# EAGLE design Hardware_Comp_V1.4 (EAGLE 9.5.2)
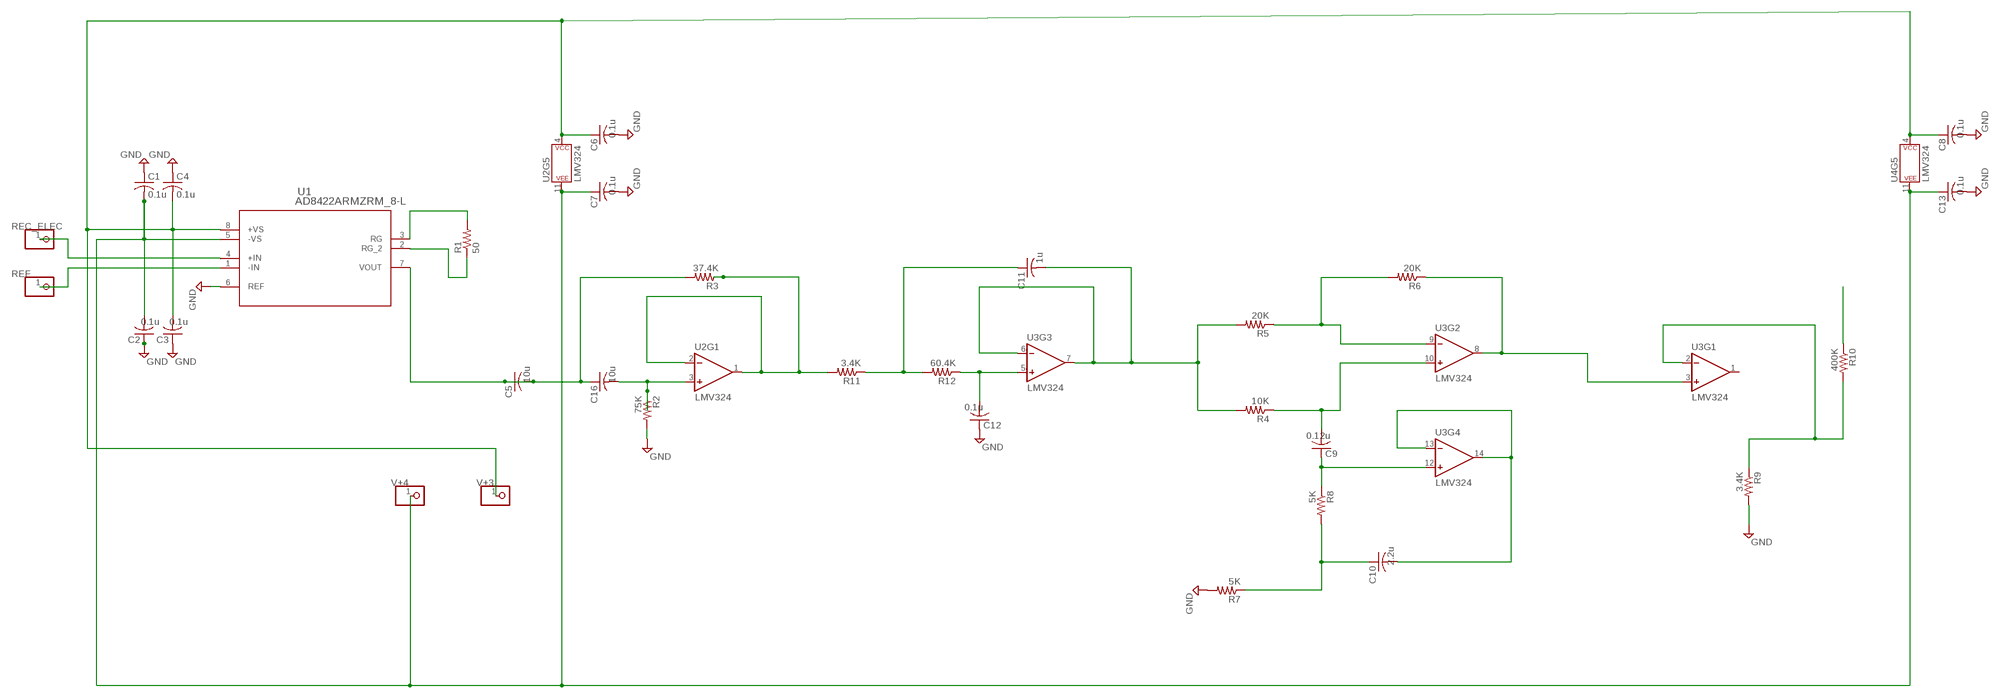
[diagram p0: schematic, sheet 1]

## Parts
9V-  PINHD-1X1  [1X01]
C1  0.1u  C-USC0603  [C0603]
C2  0.1u  C-USC0603  [C0603]
C3  0.1u  C-USC0603  [C0603]
C4  0.1u  C-USC0603  [C0603]
C5  10u  C-USC0603  [C0603]
C6  0.1u  C-USC0603  [C0603]
C7  0.1u  C-USC0603  [C0603]
C8  0.1u  C-USC0603  [C0603]
C9  0.12u  C-USC0603  [C0603]
C10  2.2u  C-USC0603  [C0603]
C11  1u  C-USC0603  [C0603]
C12  0.1u  C-USC0603  [C0603]
C13  0.1u  C-USC0603  [C0603]
C16  10u  C-USC0603  [C0603]
JP1  PINHD-1X1  [1X01]
JP2  PINHD-1X1  [1X01]
JP3  PINHD-1X1  [1X01]
R1  50  R-US_R0603  [R0603]
R2  75K  R-US_R0603  [R0603]
R3  37.4K  R-US_R0603  [R0603]
R4  10K  R-US_R0603  [R0603]
R5  20K  R-US_R0603  [R0603]
R6  20K  R-US_R0603  [R0603]
R7  5K  R-US_R0603  [R0603]
R8  5K  R-US_R0603  [R0603]
R9  3.4K  R-US_R0603  [R0603]
R10  400K  R-US_R0603  [R0603]
R11  3.4K  R-US_R0603  [R0603]
R12  60.4K  R-US_R0603  [R0603]
U1  AD8422ARMZRM_8-L  [RM_8-L]
U2  LMV324  [SO14]
U3  LMV324  [SO14]
U4  LMV324  [SO14]

## Nets
GND: C1.1 C2.1 C3.1 C4.1 C6.2 C7.2 C8.2 C12.1 C13.2 R2.2 R7.2 R9.2 U1.6(REF)
N$1: C5.1 C5.2 C16.1 R3.2 U1.7(VOUT)
N$2: R3.1 R11.2 U2.1(OUT) U2.2(-IN)
N$3: C16.2 R2.1 U2.3(+IN)
N$4: R9.1 R10.2 U3.2(-IN)
N$5: R1.2 U1.3(RG)
N$6: R1.1 U1.2(RG_2)
N$7: R6.1 U3.3(+IN) U3.8(OUT)
N$8: C10.2 U3.13(-IN) U3.14(OUT)
N$10: R5.1 R6.2 U3.9(-IN)
N$11: C9.2 R4.1 U3.10(+IN)
N$13: R10.1
N$14: C9.1 R8.1 U3.12(+IN)
N$15: C10.1 R7.1 R8.2
N$17: C12.2 R12.1 U3.5(+IN)
N$18: C11.2 R4.2 R5.2 U3.6(-IN) U3.7(OUT)
N$19: C11.1 R11.1 R12.2
REC_ELEC: JP1.1 U1.4(+IN)
REF: JP2.1 U1.1(-IN)
V+3: 9V-.1 C3.2 C4.2 C6.1 C8.1 U1.8(+VS) U2.4(P$V+) U4.4(P$V+)
V+4: C1.2 C2.2 C7.1 C13.1 JP3.1 U1.5(-VS) U2.11(P$V-) U4.11(P$V-)
Unconnected: U2.5(+IN) U2.6(-IN) U2.7(OUT) U2.8(OUT) U2.9(-IN) U2.10(+IN) U2.12(+IN) U2.13(-IN) U2.14(OUT) U3.1(OUT) U3.4(P$V+) U3.11(P$V-) U4.1(OUT) U4.2(-IN) U4.3(+IN) U4.5(+IN) U4.6(-IN) U4.7(OUT) U4.8(OUT) U4.9(-IN) U4.10(+IN) U4.12(+IN) U4.13(-IN) U4.14(OUT)

## Library data of the parts
9V- JP1-JP3 = adafruit:PINHD-1X1: Pin header 1x1 for 0.1" spacing With round pins
C1-C13 C16 = adafruit:C-US: CAPACITOR, American symbol
R1-R12 = adafruit:R-US_: RESISTOR, American symbol
U1 = AD8422ARMZ:AD8422ARMZ; BUILT_BY: EMA_UL_Team; MANUFACTURER_PART_NUMBER: AD8422ARMZ; VENDOR: Analog Devices Inc
U2-U4 = SparkFun-IC-Amplifiers:LMV324: IC LMV324 Quad Op Amp Jellybean quad op-amp Datasheet <http://cdn.sparkfun.com/datasheets/Sensors/Sound/LMV324.pdf> SparkFun Products SparkFun Sensor Kit <https://www.sparkfun.com/products/13754> (DEV-13754) SparkFun Inventor's Kit for Arduino 101 <https://www.sparkfun.com/products/13844> (KIT-13844) SparkFun Sound Detector <https://www.sparkfun.com/products/12642> (SEN-12642); PROD_ID: IC-08227

## Board
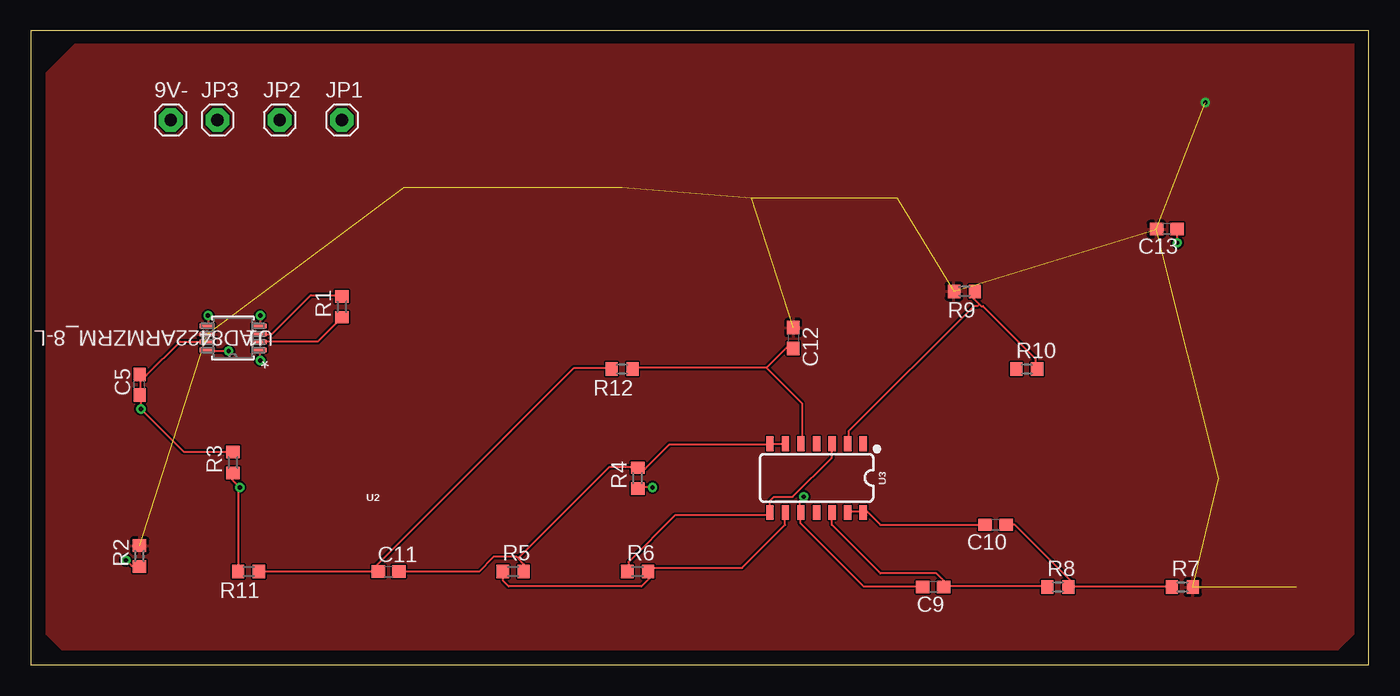
[diagram p1: board, top side]
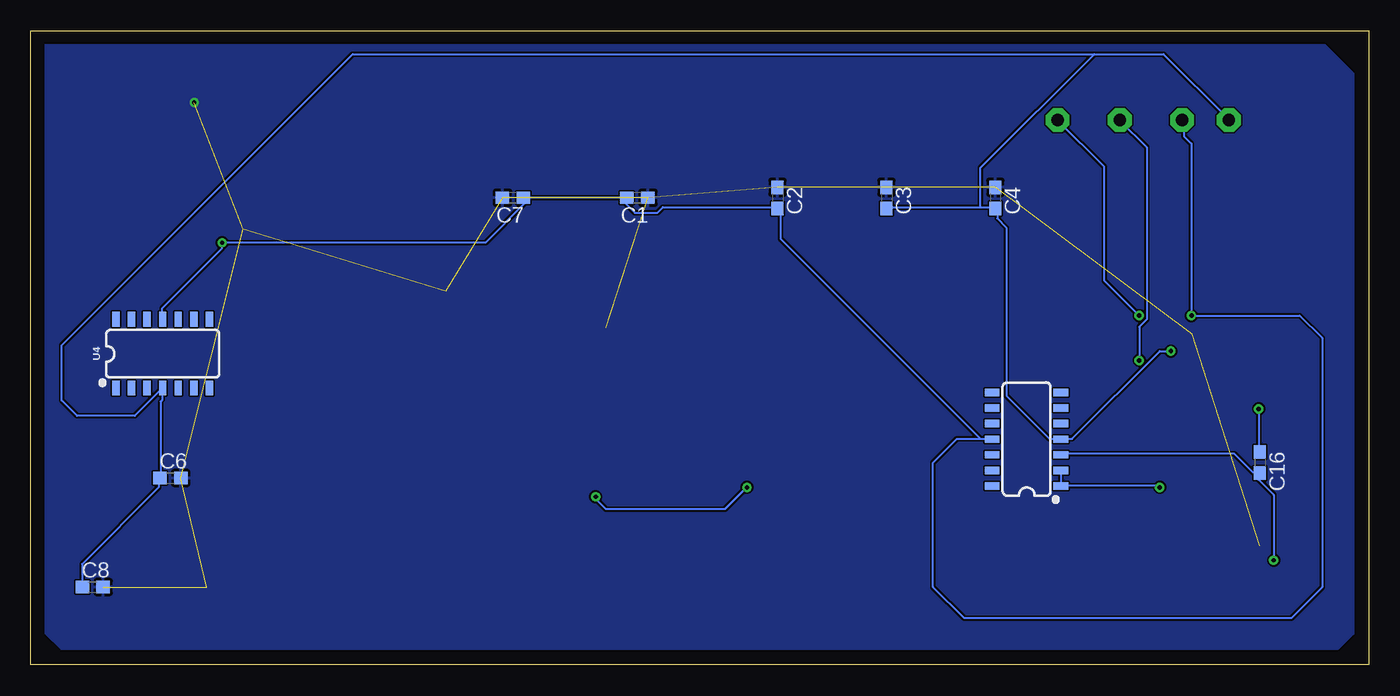
[diagram p2: board, bottom side, seen from below]

Size 109.2 x 51.74 mm. Coordinates in mm from the lower left corner, seen from the top.
Outline: 0,0 109.2,0 109.2,51.74 0,51.74 0,0
Copper layers (1*16): Top 0.035mm / dielectric 1.5mm / Bottom 0.035mm
Design rules "default": minimum track width 6mil, minimum drill 0.35mm, track to track 6mil, track to pad 6mil, pad to pad 6mil, via to via 6mil, smd to smd 6mil, copper to edge 40mil, drill to drill 6mil, minimum pad ring 10mil, minimum via ring 8mil, stop-mask expansion 4mil, vias tented up to drill 0mil, thermal gap 10mil

### Footprints (pad centres in the part's own frame; a part is rotated, then mirrored left to right if it is on the bottom)
1X01 = drill 1.016 pad 1.93 octagon: 1 0,0
C0603 = smd 1.1 x 1: 1 -0.85,0; 2 0.85,0
R0603 = smd 1 x 1.1: 1 -0.85,0; 2 0.85,0
RM_8-L = smd 1.219 x 0.381: 1 -2.121,0.975; 2 -2.121,0.325; 3 -2.121,-0.325; 4 -2.121,-0.975; 5 2.121,-0.975; 6 2.121,-0.325; 7 2.121,0.325; 8 2.121,0.975
SO14 = smd 0.6 x 1.2: 1 -3.175,-2.8; 2 -1.905,-2.8; 3 -0.635,-2.8; 4 0.635,-2.8; 5 1.905,-2.8; 6 3.175,-2.8; 7 4.445,-2.8; 8 4.445,2.8; 9 3.175,2.8; 10 1.905,2.8; 11 0.635,2.8; 12 -0.635,2.8; 13 -1.905,2.8; 14 -3.175,2.8

### Placement (x,y rotation side)
9V-  11.43,44.45 0 top
C1  59.69,38.1 180 bottom
C2  48.26,38.1 270 bottom
C3  39.37,38.1 270 bottom
C4  30.48,38.1 270 bottom
C5  8.89,22.86 90 top
C6  97.79,15.24 0 bottom
C7  69.85,38.1 180 bottom
C8  104.14,6.35 0 bottom
C9  73.66,6.35 180 top
C10  78.74,11.43 180 top
C11  29.21,7.62 0 top
C12  62.23,26.67 270 top
C13  92.71,35.56 180 top
C16  8.89,16.51 270 bottom
JP1  25.4,44.45 0 top
JP2  20.32,44.45 0 top
JP3  15.24,44.45 0 top
R1  25.4,29.21 90 top
R2  8.89,8.89 90 top
R3  16.51,16.51 90 top
R4  49.53,15.24 90 top
R5  39.37,7.62 0 top
R6  49.53,7.62 0 top
R7  93.98,6.35 0 top
R8  83.82,6.35 0 top
R9  76.2,30.48 180 top
R10  81.28,24.13 0 top
R11  17.78,7.62 180 top
R12  48.26,24.13 180 top
U1  16.51,26.67 180 top
U2  27.94,17.78 90 bottom
U3  64.77,15.24 180 top
U4  99.06,25.4 0 bottom

### Tracks (layer width: path | path; a pad name or v marks a point on that pad's centre or on a via)
GND  (via drill 0.35)  (13 unrouted)
  other vias: 95.86,45.87
  pour Bottom: 3.81,50.8 1.27,48.26 1.27,2.54 2.54,1.27 106.68,1.27 107.95,2.54 107.95,50.8
  pour Top: 3.81,50.8 1.27,48.26 1.27,2.54 2.54,1.27 106.68,1.27 107.95,2.54 107.95,50.8
N$1  (via drill 0.35)
  Top 0.152: R3.2 16.46,17.37 12.5,17.37 v8.99,20.88 8.99,21.95 C5.1 8.99,22.1 8.99,23.62 | 8.99,23.62 9.45,23.62 12.19,26.36 14.33,26.36 U1.7 | 8.99,23.62 C5.2
  Bottom 0.152: v8.99,20.88 8.99,17.37 C16.1
N$2  (via drill 0.35)
  Top 0.152: 16.92,14.48 16.92,14.63 16.46,15.09 16.46,15.54 R3.1 | 16.92,14.48 16.92,7.62 R11.2 | 16.92,14.48 v17.07,14.48
  Bottom 0.152: U2.2 25.15,15.85 25.15,14.63 U2.1 24.99,14.63 17.22,14.63 v17.07,14.48
N$3  (via drill 0.35)
  Top 0.152: v7.77,8.53 8.23,8.08 8.84,8.08 R2.1
  Bottom 0.152: v7.77,8.53 7.77,13.87 8.99,15.09 8.99,15.54 C16.2 8.99,15.7 9.45,15.7 10.97,17.22 24.99,17.22 U2.3
N$4
  Top 0.152: 77.42,29.41 76.96,29.87 76.96,30.48 R9.1 | 77.42,29.41 77.57,29.26 77.72,29.26 81.99,24.99 81.99,24.23 R10.2 | 77.42,29.41 77.27,29.26 76.96,29.26 66.75,19.05 66.75,18.14 U3.2
N$5
  Top 0.152: R1.2 25.3,30.18 22.86,30.18 19.66,26.98 18.75,26.98 U1.3
N$6
  Top 0.152: U1.2 18.75,26.36 23.41,26.36 R1.1
N$7
  Top 0.152: R6.1 48.77,7.62 48.77,8.38 52.58,12.19 60.2,12.19 60.35,12.34 U3.8 60.35,12.5 60.35,13.41 60.66,13.72 62.18,13.72 65.38,16.92 65.38,17.98 U3.3
N$8
  Top 0.152: C10.2 69.34,11.43 68.28,12.5 67.97,12.5 | 67.97,12.5 67.82,12.65 67.67,12.5 66.75,12.5 U3.13 | 67.97,12.5 U3.14
N$10
  Top 0.152: 50.44,7.62 50.44,7.01 49.84,6.4 39.01,6.4 38.56,6.86 38.56,7.62 R5.1 | 50.44,7.62 50.75,7.92 58.06,7.92 61.57,11.43 61.57,12.34 U3.9 | 50.44,7.62 R6.2
N$11  (via drill 0.35)
  Top 0.152: v50.75,14.48 49.53,14.48 R4.1 | v63.09,13.72 62.79,13.41 62.79,12.5 U3.10 62.79,12.34 62.79,11.58 67.97,6.4 72.69,6.4 C9.2
  Bottom 0.152: 52.58,12.7 50.8,14.48 v50.75,14.48 52.53,12.7 62.23,12.7 63.09,13.56 v63.09,13.72
N$14
  Top 0.152: 74.52,6.4 82.91,6.4 R8.1 | 74.52,6.4 74.52,6.86 73.91,7.47 69.34,7.47 65.38,11.43 65.38,12.34 U3.12 | 74.52,6.4 C9.1
N$15
  Top 0.152: C10.1 80.31,11.43 84.89,6.86 84.89,6.55 84.73,6.4 | 84.73,6.4 93.12,6.4 R7.1 | 84.73,6.4 R8.2
N$17
  Top 0.152: 60.05,24.23 49.23,24.23 R12.1 | 60.05,24.23 61.72,25.91 62.18,25.91 C12.2 | 60.05,24.23 62.94,21.34 62.94,18.14 U3.5
N$18
  Top 0.152: U3.6 61.57,17.98 60.35,17.98 U3.7 60.2,17.98 52.12,17.98 50.14,16 49.53,16 R4.2 49.53,16.15 47.24,16.15 39.78,8.69 | C11.2 36.58,7.62 37.8,8.84 39.62,8.84 39.78,8.69 | 39.78,8.69 40.23,8.23 40.23,7.62 R5.2
N$19
  Top 0.152: 28.19,7.62 C11.1 28.35,7.62 | 28.19,7.62 R11.1 | 28.19,7.62 28.19,8.08 44.35,24.23 47.4,24.23 R12.2
REC_ELEC  (via drill 0.35)
  Top 0.152: v18.75,28.5 18.75,27.74 U1.4
  Bottom 0.152: JP1.1 21.59,40.64 21.59,31.34 v18.75,28.5
REF  (via drill 0.35)
  Top 0.152: v18.75,24.84 18.75,25.6 U1.1
  Bottom 0.152: v18.75,24.84 18.75,27.58 18.14,28.19 18.14,42.22 20.27,44.35 JP2.1
V+3  (via drill 0.35)
  Top 0.152: v16.15,25.6 14.48,25.6 U1.8
  Bottom 0.152: C8.1 105,6.4 105,8.23 98.75,14.48 98.75,15.24 C6.1 98.6,15.24 98.6,21.49 98.45,21.64 98.45,22.55 U4.4 100.7,20.32 105.41,20.32 106.68,21.59 106.68,26.06 82.91,49.84 22.4,49.84 | 31.7,37.34 39.32,37.34 C3.2 | 31.7,37.34 30.48,37.34 C4.2 30.48,37.19 30.33,37.03 30.33,36.42 29.57,35.66 29.57,21.95 26.06,18.44 25.15,18.44 U2.4 24.99,18.44 24.23,18.44 17.07,25.6 v16.15,25.6 | 22.4,49.84 16.76,49.84 11.43,44.5 9V-.1 | 22.4,49.84 31.7,40.54 31.7,37.34
V+4  (via drill 0.35)
  Top 0.152: v14.48,28.5 14.48,27.74 U1.5 | v93.57,34.44 93.57,35.51 C13.1
  Bottom 0.152: JP3.1 15.24,44.35 15.09,44.2 15.09,43.13 14.48,42.52 v14.48,28.5 5.64,28.5 3.81,26.67 3.81,6.35 6.35,3.81 33.02,3.81 35.56,6.35 35.56,16.51 33.63,18.44 31.7,18.44 | U4.11 98.45,28.35 98.45,29.11 93.57,33.98 v93.57,34.44 72.08,34.44 68.89,37.64 68.89,38.1 | 60.66,38.1 60.66,37.64 59.89,36.88 58.06,36.88 57.61,37.34 48.31,37.34 C2.2 48.16,37.19 48.01,37.03 48.01,34.75 31.7,18.44 | 60.66,38.1 68.89,38.1 | 60.66,38.1 C1.2 | 31.7,18.44 30.79,18.44 U2.11 30.64,18.44 30.63,18.44 | 68.89,38.1 C7.1 | 30.48,18.44 30.63,18.44 | 31.09,18.44 30.63,18.44